# EAGLE design BT136-Simple-Soldering-Iron (EAGLE 7.4.0)
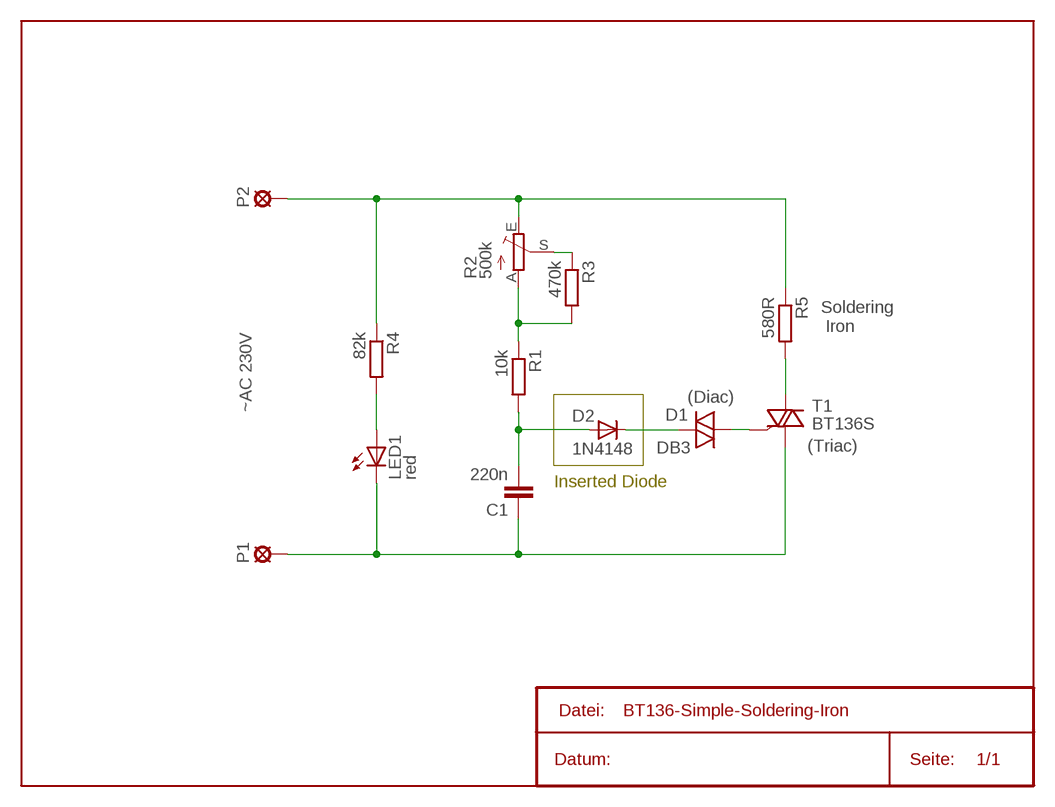
[diagram p0: schematic, sheet 1]

## Parts
C1  220n  C-EU050-025X075  [C050-025X075]
D1  DB3  ER900  [ER900]
D2  1N4148  1N4148DO35-7  [DO35-7]
LED1  red  LEDSML1206  [SML1206]
P1  LSP10  [LSP10]
P2  LSP10  [LSP10]
R1  10k  R-EU_R1210  [R1210]
R2  500k  TRIM_EU-RS3  [RS3]
R3  470k  R-EU_R1210  [R1210]
R4  82k  R-EU_R1210  [R1210]
R5  580R  R-EU_0207/7  [0207/7]
T1  BT136S  BT136D  [DPAK]

## Nets
N$1: D1.1 T1.3(G)
N$2: C1.2 D2.A R1.2
N$3: C1.1 LED1.C P1.MP T1.1(A1)
N$4: R1.1 R2.A R3.2
N$5: R2.S R3.1
N$6: R5.2 T1.4(A2)
N$7: P2.MP R2.E R4.1 R5.1
N$8: D1.2 D2.C
N$9: LED1.A R4.2

## Notes on the sheet
- Soldering
   Iron
- (Diac)
- ~AC 230V
- (Triac)
- Inserted Diode

## Library data of the parts
C1 = rcl:C-EU: CAPACITOR, European symbol
D1 = triac:ER900: TRIGGER DIODE
D2 = diode1:1N4148: DIODE high speed (Philips)
LED1 = led:LED: LED OSRAM: - CHIPLED LG R971, LG N971, LY N971, LG Q971, LY Q971, LO R971, LY R971 LH N974, LH R974 LS Q976, LO Q976, LY Q976 LO Q996 - Hyper CHIPLED LW Q18S LB Q993, LB Q99A, LB R99A - SideLED LS A670, LO A670, LY A670, LG A670, LP A670 LB A673, LV A673, LT A673, LW A673 LH A674 LY A675 LS A676, LA A676, LO A676, LY A676, LW A676 LS A679, LY A679, LG A679 - Hyper Micro SIDELED® LS Y876, LA Y876, LO Y876, LY Y876 LT Y87S - SmartLED LW L88C, LW L88S LB L89C, LB L89S, LG L890 LS L89K, LO L89K, LY L89K LS L896, LA L896, LO L896, LY L896 - TOPLED LS T670, LO T670, LY T670, LG T670, LP T670 LSG T670, LSP T670, LSY T670, LOP T670, LYG T670 LG T671, LOG T671, LSG T671 LB T673, LV T673, LT T673, LW T673 LH T674 LS T676, LA T676, LO T676, LY T676, LB T676, LH T676, LSB T676, LW T676 LB T67C, LV T67C, LT T67C, LS T67K, LO T67K, LY T67K, LW E67C LS E67B, LA E67B, LO E67B, LY E67B, LB E67C, LV E67C, LT E67C LW T67C LS T679, LY T679, LG T679 LS T770, LO T770, LY T770, LG T770, LP T770 LB T773, LV T773, LT T773, LW T773 LH T774 LS E675, LA E675, LY E675, LS T675 LS T776, LA T776, LO T776, LY T776, LB T776 LHGB T686 LT T68C, LB T68C - Hyper Mini TOPLED® LB M676 - Mini TOPLED Santana® LG M470 LS M47K, LO M47K, LY M47K Source: http://www.osram.convergy.de LUXEON: - LUMILED® LXK2-PW12-R00, LXK2-PW12-S00, LXK2-PW14-U00, LXK2-PW14-V00 LXK2-PM12-R00, LXK2-PM12-S00, LXK2-PM14-U00 LXK2-PE12-Q00, LXK2-PE12-R00, LXK2-PE12-S00, LXK2-PE14-T00, LXK2-PE14-U00 LXK2-PB12-K00, LXK2-PB12-L00, LXK2-PB12-M00, LXK2-PB14-N00, LXK2-PB14-P00, LXK2-PB14-Q00 LXK2-PR12-L00, LXK2-PR12-M00, LXK2-PR14-Q00, LXK2-PR14-R00 LXK2-PD12-Q00, LXK2-PD12-R00, LXK2-PD12-S00 LXK2-PH12-R00, LXK2-PH12-S00 LXK2-PL12-P00, LXK2-PL12-Q00, LXK2-PL12-R00 Source: www.luxeon.com KINGBRIGHT: KA-3528ASYC Source: www.kingbright.com
P1 P2 = solpad:LSP10: SOLDER PAD drill 1.0 mm, distributor Buerklin, 12H555
R1 R3-R5 = rcl:R-EU_: RESISTOR, European symbol
R2 = pot:TRIM_EU-: POTENTIOMETER
T1 = triac:BT136: Triac BT136 series E sensitive gate Source: http://www.nxp.com/acrobat_download/datasheets/BT136_SERIES_E_2.pdf

## Board
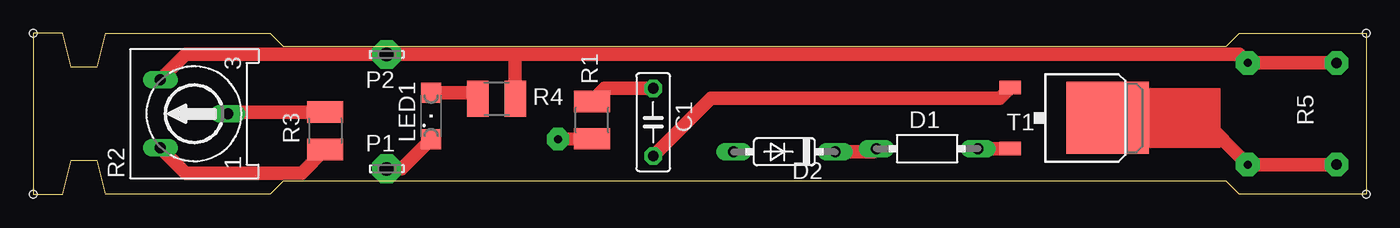
[diagram p1: board, top side]
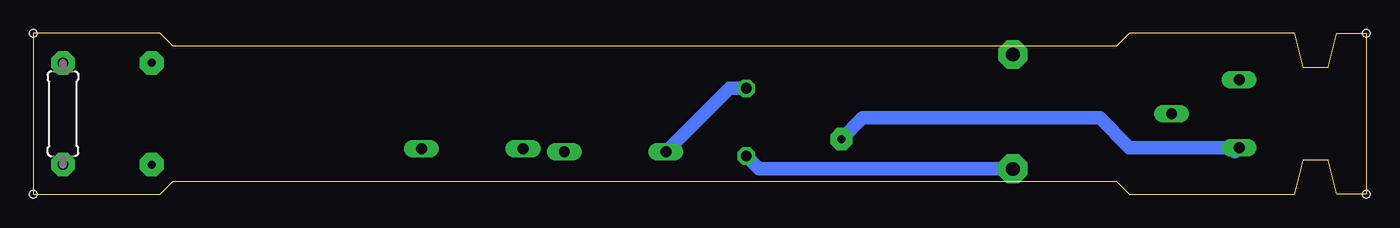
[diagram p2: board, bottom side, seen from below]

Size 100.01 x 12.06 mm. Coordinates in mm from the lower left corner, seen from the top.
Outline: 5.4,12.06 17.78,12.06 18.73,11.11 89.54,11.11 90.49,12.06 100.01,12.06 100.01,0 90.49,0 89.54,0.95 18.73,0.95 17.78,0 5.4,0 4.76,2.54 2.86,2.54 2.22,0 0,0 0,12.06 2.22,12.06 2.86,9.53 4.76,9.53 5.4,12.06
Copper layers (1*16): Top 0.035mm / dielectric 1.5mm / Bottom 0.035mm
Design rules "default": minimum track width 10mil, minimum drill 24mil, track to track 8mil, track to pad 8mil, pad to pad 8mil, via to via 8mil, smd to smd 8mil, copper to edge 40mil, drill to drill 8mil, minimum pad ring 10mil, minimum via ring 8mil, stop-mask expansion 4mil, vias tented up to drill 0mil, thermal gap 10mil
Holes 0.6 mm at 0,0 0,12.06 100.01,12.06 100.01,0

### Footprints (pad centres in the part's own frame; a part is rotated, then mirrored left to right if it is on the bottom)
C050-025X075 = drill 0.813 octagon: 1 -2.54,0; 2 2.54,0
ER900 = drill 0.813 long: 1 -3.81,0; 2 3.81,0
DO35-7 = drill 0.813 long: A 3.81,0; C -3.81,0
SML1206 = smd 1.5 x 1.5: A 1.75,0; C -1.75,0
LSP10 = drill 1.016 pad 2.159 octagon: MP 0,0
R1210 = smd 1.6 x 2.7: 1 -1.4,0; 2 1.4,0
RS3 = drill 0.813 long: A -2.54,2.54; E 2.54,2.54; S 0,-2.54
0207/7 = drill 0.813 octagon: 1 -3.81,0; 2 3.81,0
DPAK = smd 1 x 1.6: 1 -2.28,-6.07; 3 2.28,-6.07 | smd 5.4 x 6.2: 4 0,1.23

### Placement (x,y rotation side)
C1  46.51,5.4 90 top
D1  67.07,3.41 180 top
D2  56.36,3.17 180 top
LED1  29.85,5.87 90 top
P1  26.51,1.91 0 top
P2  26.51,10.48 0 top
R1  41.91,5.56 90 top
R2  12.07,6.03 90 top
R3  21.91,4.76 270 top
R4  34.77,7.14 180 top
R5  97.79,6.03 270 bottom
T1  79.38,5.71 270 top

### Tracks (layer width: path | path; a pad name or v marks a point on that pad's centre or on a via)
N$1
  Top 1.016: T1.3 73.04,3.41 D1.1
N$2
  Top 1.016: R1.2 42.86,7.94 C1.2
  Bottom 1.016: D2.A 47.78,7.94 C1.2
N$3
  Top 1.016: P1.MP 27.62,1.91 LED1.C | T1.1 72.51,7.2 50.86,7.2 C1.1
  Bottom 1.016: C1.1 45.56,1.91 P1.MP
N$4  (via drill 0.6 pad 1.68)
  Top 1.016: R1.1 v39.37,4.13 | 9.66,3.36 R2.A 11.43,1.59 20.13,1.59 R3.2
  Bottom 1.016: 9.84,3.17 R2.A 17.78,3.49 20,5.71 37.78,5.71 v39.37,4.13
N$5
  Top 1.016: R2.S 14.74,6.16 R3.1
N$6  (via drill 0.6 pad 1.78)
  Top 1.016: R5.2 v91.12,2.22 87.63,5.71 T1.4
  other vias: 97.79,2.22
N$7  (via drill 0.6 pad 1.78)
  Top 1.016: R2.E 11.43,10.48 P2.MP 36.17,10.48 | 36.17,10.48 R4.1 | 36.17,10.48 90.49,10.48 v91.12,9.84 R5.1
  other vias: 97.79,9.84
N$8
  Top 1.016: D2.C 63.02,3.17 D1.2
N$9
  Top 1.016: R4.2 32.86,7.62 LED1.A
(copper drawn outside any net)
  shapes: Top area x1

### Text on the board
Unrouted: 230VAC | Inserted Diode
tValues: (Triac 4A) | (Diac)